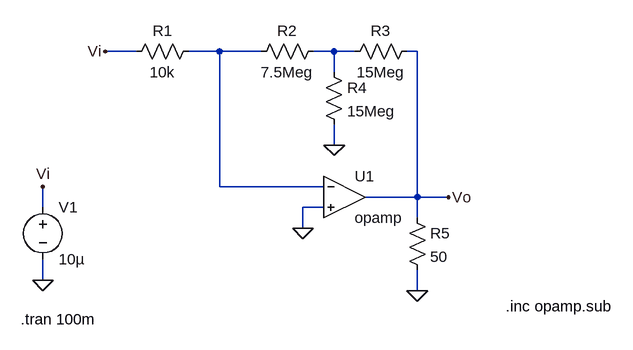
[diagram p0: schematic ej1b.asc]
ej1b.asc, the LTspice schematic file:
Version 4
SHEET 1 880 680
WIRE 16 -16 -32 -16
WIRE 144 -16 96 -16
WIRE 208 -16 144 -16
WIRE 320 -16 288 -16
WIRE 352 -16 320 -16
WIRE 448 -16 432 -16
WIRE 320 16 320 -16
WIRE 320 128 320 96
WIRE 144 192 144 -16
WIRE 304 192 144 192
WIRE 448 208 448 -16
WIRE 448 208 368 208
WIRE 496 208 448 208
WIRE -128 224 -128 192
WIRE 304 224 272 224
WIRE 448 240 448 208
WIRE 272 256 272 224
WIRE -128 336 -128 304
WIRE 448 352 448 320
FLAG 320 128 0
FLAG 448 352 0
FLAG 496 208 Vo
FLAG -32 -16 Vi
FLAG 272 256 0
FLAG -128 192 Vi
FLAG -128 336 0
SYMBOL OpAmps\\opamp 336 144 R0
SYMATTR InstName U1
SYMBOL res 112 -32 R90
WINDOW 0 0 56 VBottom 2
WINDOW 3 32 56 VTop 2
SYMATTR InstName R1
SYMATTR Value 10k
SYMBOL res 304 -32 R90
WINDOW 0 0 56 VBottom 2
WINDOW 3 32 56 VTop 2
SYMATTR InstName R2
SYMATTR Value 7.5Meg
SYMBOL res 336 0 R270
WINDOW 0 32 56 VTop 2
WINDOW 3 0 56 VBottom 2
SYMATTR InstName R3
SYMATTR Value 15Meg
SYMBOL res 304 0 R0
SYMATTR InstName R4
SYMATTR Value 15Meg
SYMBOL res 432 224 R0
SYMATTR InstName R5
SYMATTR Value 50
SYMBOL voltage -128 208 R0
WINDOW 123 0 0 Left 0
WINDOW 39 0 0 Left 0
SYMATTR InstName V1
SYMATTR Value 10µ
TEXT 584 376 Left 2 !.inc opamp.sub
TEXT -162 396 Left 2 !.tran 100m

The netlist it stands for:
* ej1b.asc
XU1 N001 0 Vo opamp Aol=100K GBW=10Meg  ; pins invin noninvin out
R1 N001 Vi 10k
R2 N002 N001 7.5Meg
R3 N002 Vo 15Meg
R4 N002 0 15Meg
R5 Vo 0 50
V1 Vi 0 10µ
.inc opamp.sub
.tran 100m
.backanno
.end